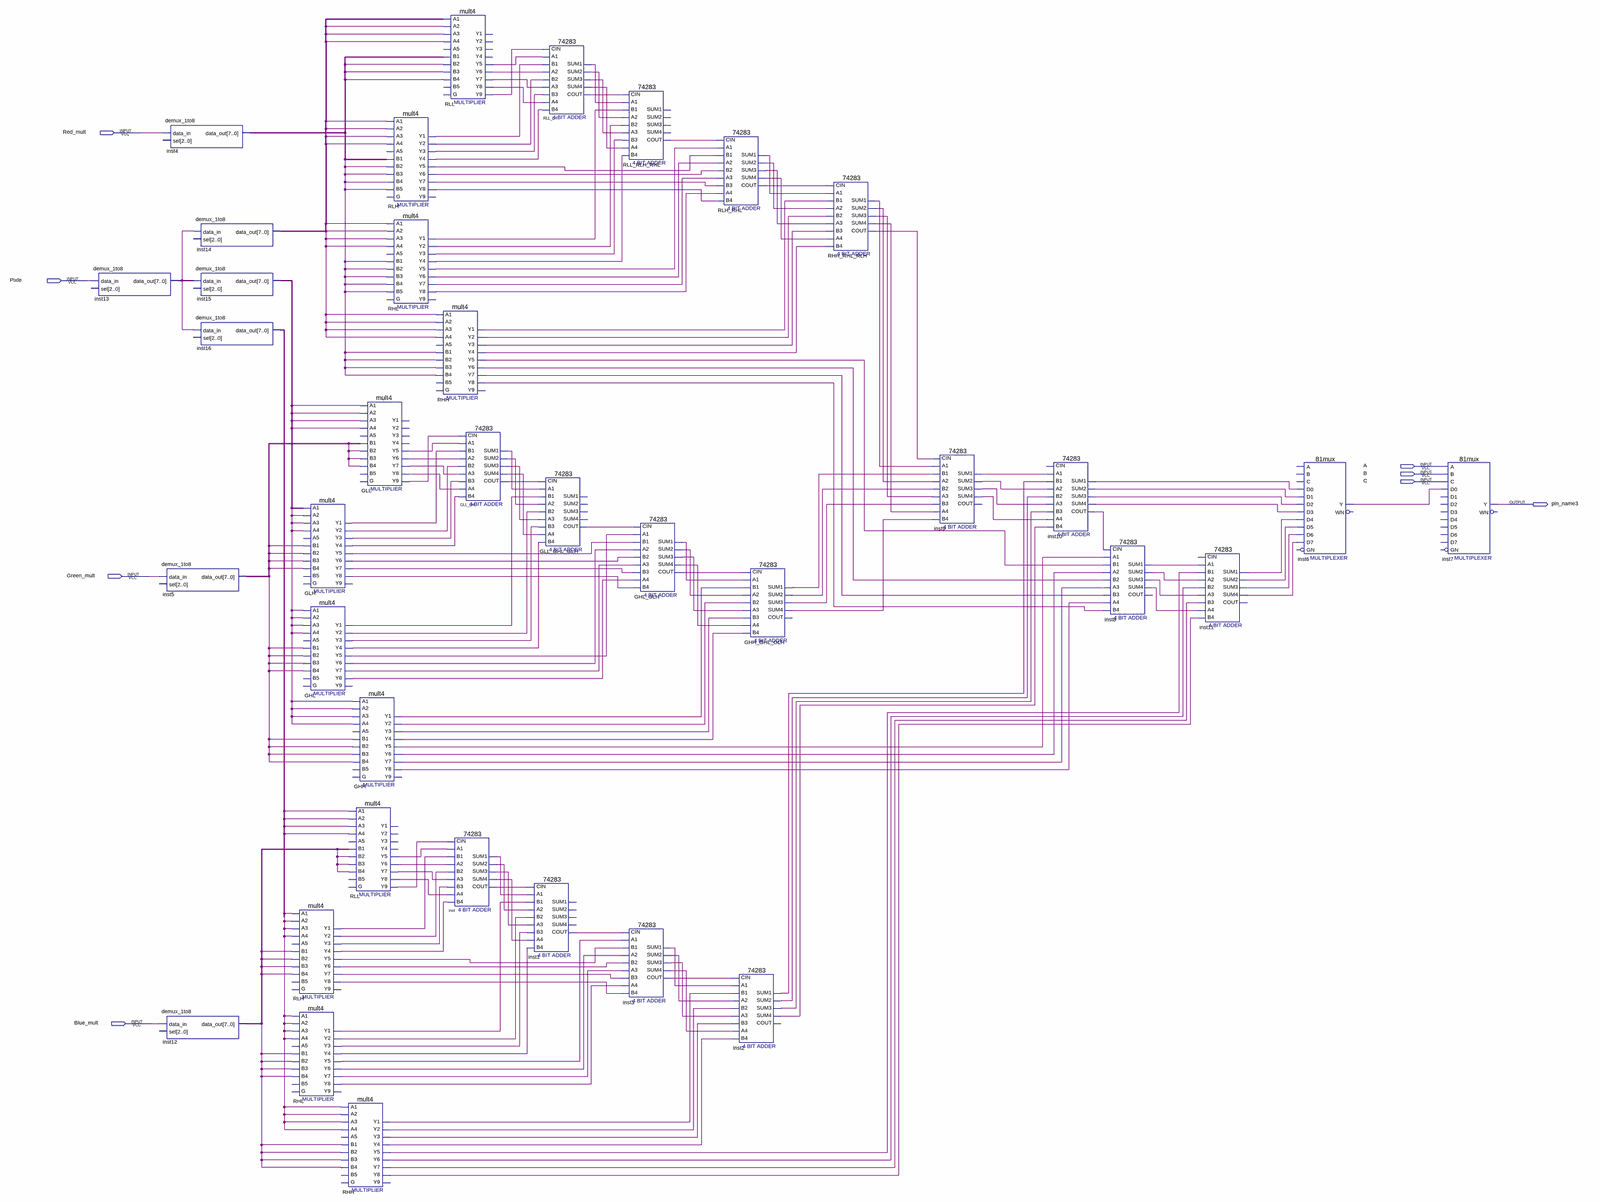
[diagram p0: schematic sheet, whole]
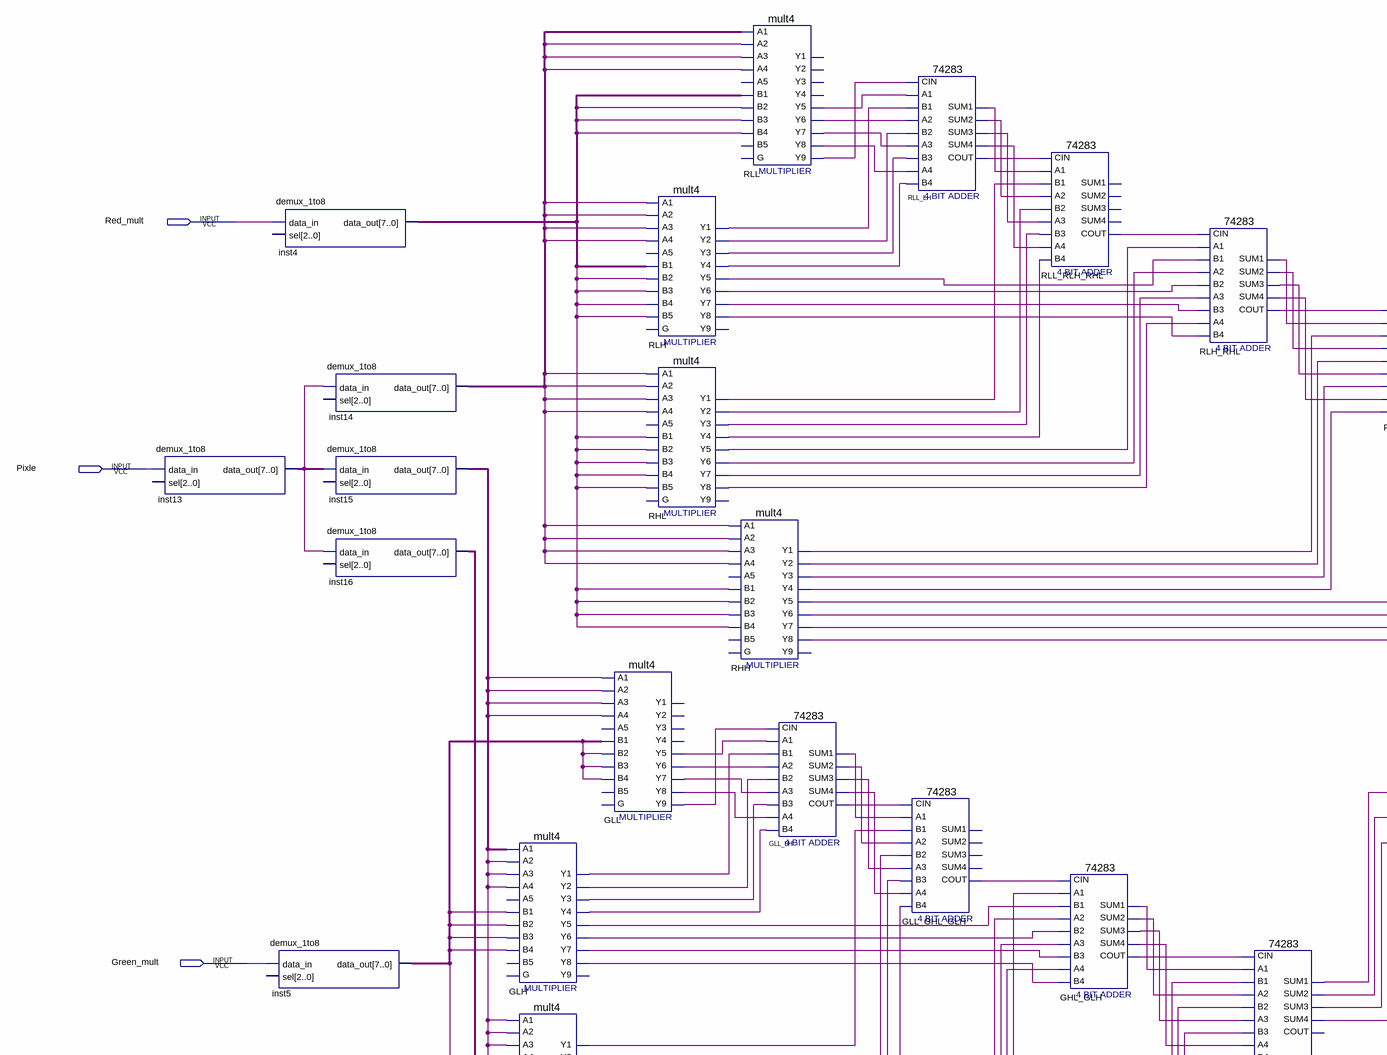
[diagram p1: schematic sheet, upper left part]
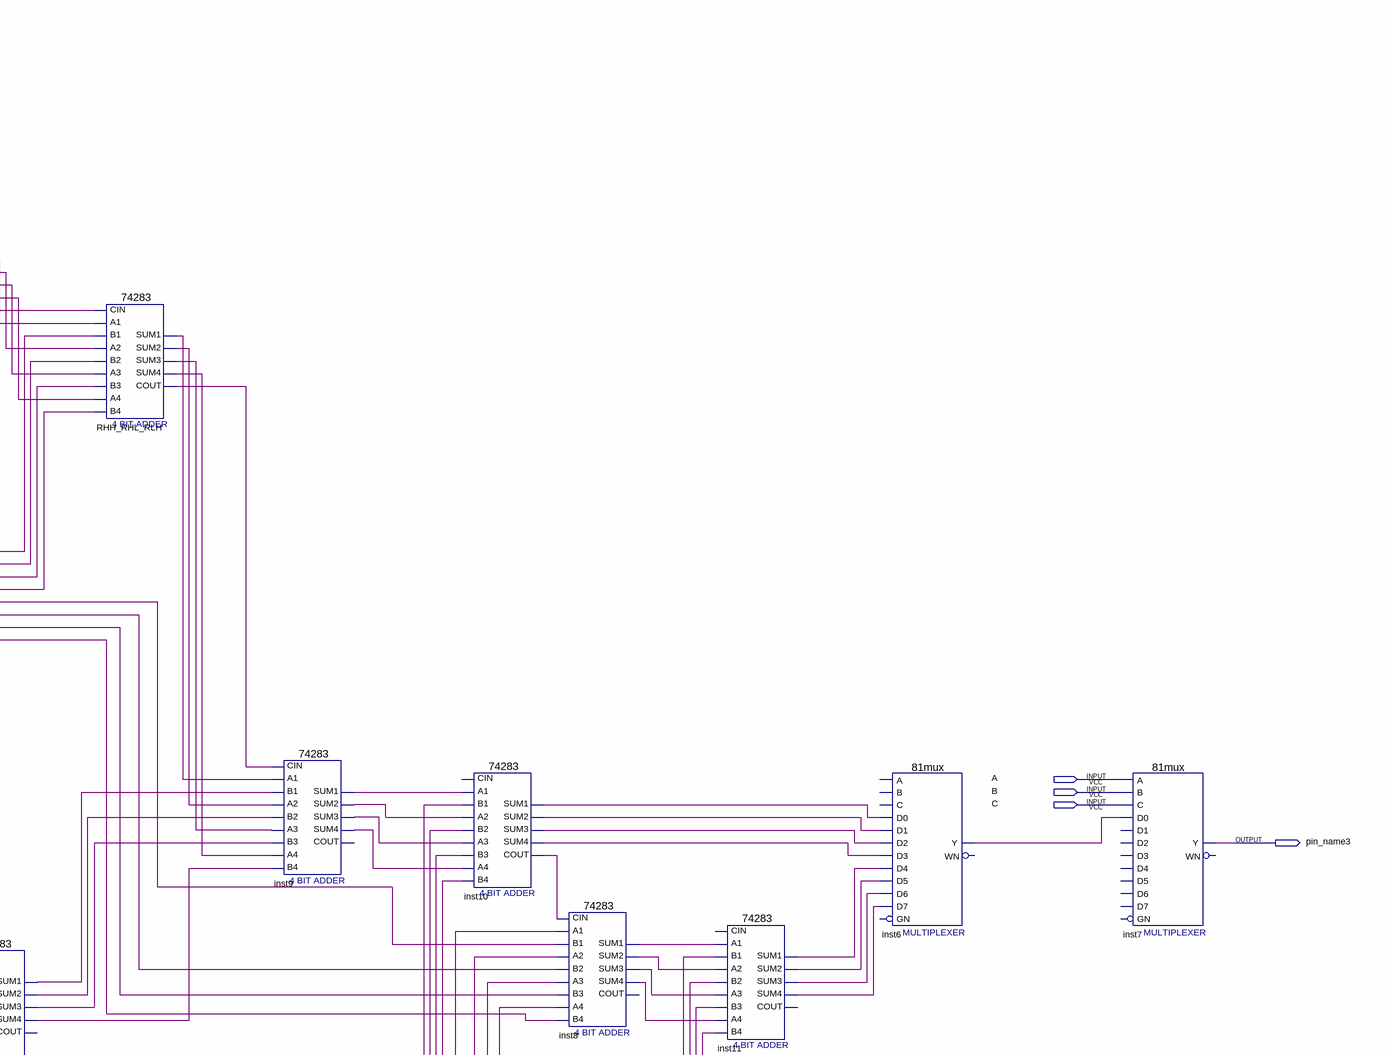
[diagram p2: schematic sheet, upper right part]
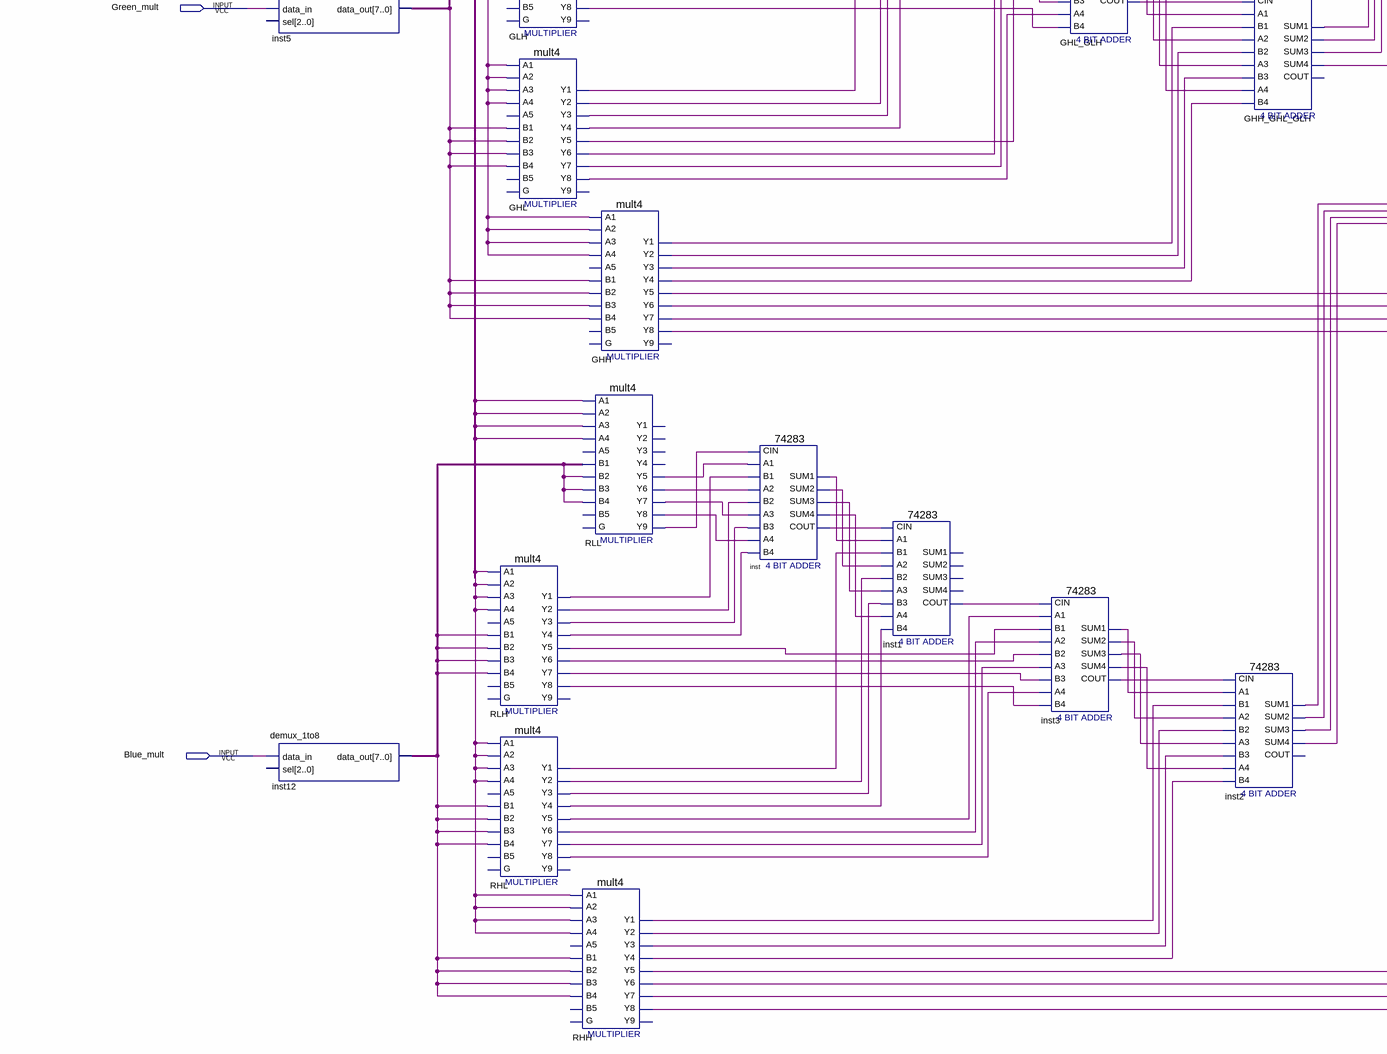
[diagram p3: schematic sheet, lower left part]
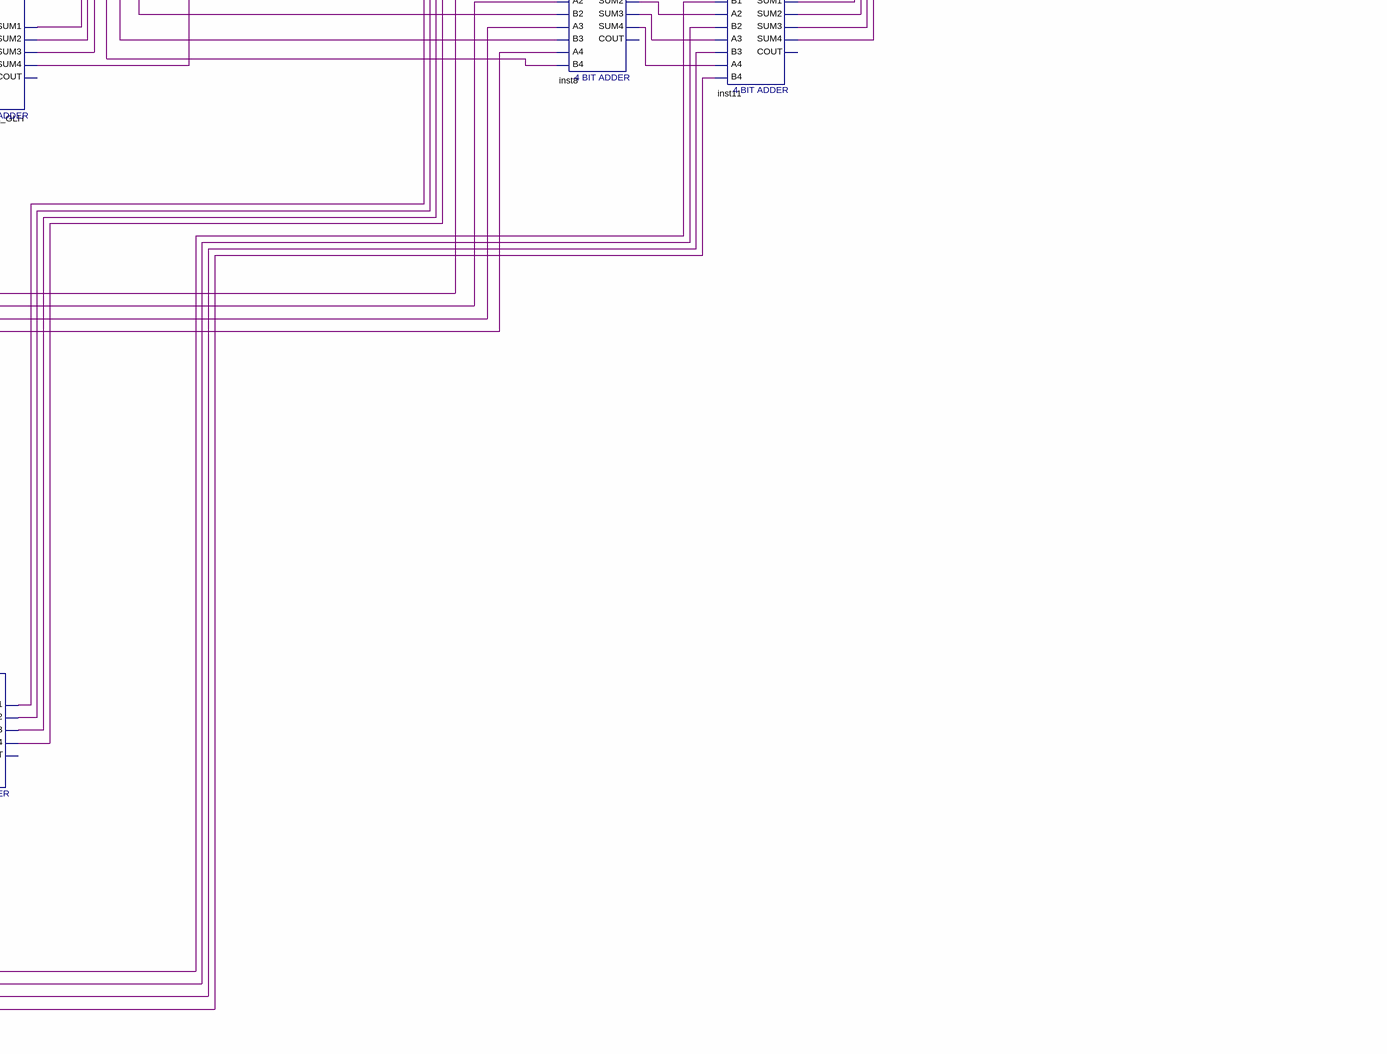
[diagram p4: schematic sheet, lower right part]
// Quartus schematic greyscale.bdf as structural Verilog: 37 symbols, 8 pins
module greyscale (
  input  Red_mult,
  input  Pixle,
  input  A,
  input  B,
  input  C,
  input  Green_mult,
  input  Blue_mult,
  output pin_name3
);

  wire GHH_GHL_GLH_sum1, GHH_GHL_GLH_sum2, GHH_GHL_GLH_sum3, GHH_GHL_GLH_sum4, GHH_y1, GHH_y2, GHH_y3,
       GHH_y4, GHH_y5, GHH_y6, GHH_y7, GHH_y8, GHL_GLH_cout, GHL_GLH_sum1, GHL_GLH_sum2, GHL_GLH_sum3,
       GHL_GLH_sum4, GHL_y1, GHL_y2, GHL_y3, GHL_y4, GHL_y5, GHL_y6, GHL_y7, GHL_y8, GLH_y1, GLH_y2, GLH_y3,
       GLH_y4, GLH_y5, GLH_y6, GLH_y7, GLH_y8, GLL_GHL_GLH_cout, GLL_LH_cout, GLL_LH_sum1, GLL_LH_sum2,
       GLL_LH_sum3, GLL_LH_sum4, GLL_y5, GLL_y6, GLL_y7, GLL_y8, GLL_y9, inst1_cout, inst2_sum1, inst2_sum2,
       inst2_sum3, inst2_sum4, inst3_cout, inst3_sum1, inst3_sum2, inst3_sum3, inst3_sum4, inst6_y,
       inst8_sum1, inst8_sum2, inst8_sum3, inst8_sum4, inst9_sum1, inst9_sum2, inst9_sum3, inst9_sum4,
       inst10_cout, inst10_sum1, inst10_sum2, inst10_sum3, inst10_sum4, inst11_sum1, inst11_sum2,
       inst11_sum3, inst11_sum4, inst_cout, inst_sum1, inst_sum2, inst_sum3, inst_sum4, RHH_RHL_RLH_cout,
       RHH_RHL_RLH_sum1, RHH_RHL_RLH_sum2, RHH_RHL_RLH_sum3, RHH_RHL_RLH_sum4, RHH_y1, RHH_y1_2, RHH_y2,
       RHH_y2_2, RHH_y3, RHH_y3_2, RHH_y4, RHH_y4_2, RHH_y5, RHH_y5_2, RHH_y6, RHH_y6_2, RHH_y7, RHH_y7_2,
       RHH_y8, RHH_y8_2, RHL_y1, RHL_y1_2, RHL_y2, RHL_y2_2, RHL_y3, RHL_y3_2, RHL_y4, RHL_y4_2, RHL_y5,
       RHL_y5_2, RHL_y6, RHL_y6_2, RHL_y7, RHL_y7_2, RHL_y8, RHL_y8_2, RLH_RHL_cout, RLH_RHL_sum1,
       RLH_RHL_sum2, RLH_RHL_sum3, RLH_RHL_sum4, RLH_y1, RLH_y1_2, RLH_y2, RLH_y2_2, RLH_y3, RLH_y3_2,
       RLH_y4, RLH_y4_2, RLH_y5, RLH_y5_2, RLH_y6, RLH_y6_2, RLH_y7, RLH_y7_2, RLH_y8, RLH_y8_2, RLL_LH_cout,
       RLL_LH_sum1, RLL_LH_sum2, RLL_LH_sum3, RLL_LH_sum4, RLL_RLH_RHL_cout, RLL_y5, RLL_y5_2, RLL_y6,
       RLL_y6_2, RLL_y7, RLL_y7_2, RLL_y8, RLL_y8_2, RLL_y9, RLL_y9_2, undriven, undriven_2, undriven_3,
       undriven_4, undriven_5, undriven_6, undriven_7, undriven_8, undriven_9, undriven_10, undriven_11,
       undriven_12, undriven_13, undriven_14, undriven_15, undriven_16, undriven_17, undriven_18,
       undriven_19, undriven_20, undriven_21, undriven_22, undriven_23, undriven_24, undriven_25,
       undriven_26, undriven_27, undriven_28, undriven_29, undriven_30, undriven_31, undriven_32,
       undriven_33, undriven_34, undriven_35, undriven_36, undriven_37;
  wire [7:0] inst4_data_out, inst5_data_out, inst12_data_out, inst13_data_out, inst14_data_out,
       inst15_data_out, inst16_data_out;

  demux_1to8 inst13 (.data_in(Pixle), .data_out(inst13_data_out));  // open: sel
  demux_1to8 inst4 (.data_in(Red_mult), .data_out(inst4_data_out));  // open: sel
  demux_1to8 inst5 (.data_in(Green_mult), .data_out(inst5_data_out));  // open: sel
  demux_1to8 inst12 (.data_in(Blue_mult), .data_out(inst12_data_out));  // open: sel
  demux_1to8 inst14 (.data_in(undriven_4), .data_out(inst14_data_out));  // open: sel
  demux_1to8 inst15 (.data_in(inst13_data_out), .data_out(inst15_data_out));  // open: sel
  demux_1to8 inst16 (.data_in(undriven_4), .data_out(inst16_data_out));  // open: sel
  mult4 GLH (
    .A2(undriven_15), .A3(undriven_15), .A4(undriven_15), .B2(undriven_28), .B1(undriven_27),
    .B3(undriven_29), .B4(undriven_30), .A1(inst15_data_out), .Y6(GLH_y6), .Y1(GLH_y1), .Y2(GLH_y2),
    .Y3(GLH_y3), .Y4(GLH_y4), .Y5(GLH_y5), .Y7(GLH_y7), .Y8(GLH_y8));  // open: A5, G, B5, Y9
  mult4 GHL (
    .A2(undriven_15), .A3(undriven_15), .A4(undriven_15), .B2(undriven_31), .B1(undriven_31),
    .B3(undriven_31), .B4(undriven_31), .A1(undriven_15), .Y6(GHL_y6), .Y1(GHL_y1), .Y2(GHL_y2), .Y3(GHL_y3),
    .Y4(GHL_y4), .Y5(GHL_y5), .Y7(GHL_y7), .Y8(GHL_y8));  // open: A5, G, B5, Y9
  mult4 RLH (
    .A2(undriven_25), .A3(undriven_25), .A4(undriven_25), .B2(undriven_34), .B1(undriven_33),
    .B3(undriven_35), .B4(undriven_36), .A1(undriven_24), .Y6(RLH_y6_2), .Y1(RLH_y1_2), .Y2(RLH_y2_2),
    .Y3(RLH_y3_2), .Y4(RLH_y4_2), .Y5(RLH_y5_2), .Y7(RLH_y7_2), .Y8(RLH_y8_2));  // open: A5, G, B5, Y9
  mult4 RHL (
    .A2(undriven_25), .A3(undriven_25), .A4(undriven_25), .B2(undriven_37), .B1(undriven_37),
    .B3(undriven_37), .B4(undriven_37), .A1(undriven_25), .Y6(RHL_y6_2), .Y1(RHL_y1_2), .Y2(RHL_y2_2),
    .Y3(RHL_y3_2), .Y4(RHL_y4_2), .Y5(RHL_y5_2), .Y7(RHL_y7_2), .Y8(RHL_y8_2));  // open: A5, G, B5, Y9
  mult4 GLL (
    .A2(undriven_17), .A3(undriven_18), .A4(undriven_19), .B2(undriven_26), .B1(inst5_data_out),
    .B3(undriven_26), .B4(undriven_26), .A1(undriven_16), .Y6(GLL_y6), .Y5(GLL_y5), .Y9(GLL_y9), .Y7(GLL_y7),
    .Y8(GLL_y8));  // open: A5, G, B5, Y1, Y2, Y3, Y4
  mult4 GHH (
    .A2(undriven_15), .A3(undriven_15), .A4(undriven_15), .B2(undriven_31), .B1(undriven_31),
    .B3(undriven_31), .B4(undriven_31), .A1(undriven_15), .Y6(GHH_y6), .Y1(GHH_y1), .Y2(GHH_y2), .Y3(GHH_y3),
    .Y4(GHH_y4), .Y5(GHH_y5), .Y7(GHH_y7), .Y8(GHH_y8));  // open: A5, G, B5, Y9
  mult4 RLL (
    .A2(undriven_21), .A3(undriven_22), .A4(undriven_23), .B2(undriven_32), .B1(inst12_data_out),
    .B3(undriven_32), .B4(undriven_32), .A1(undriven_20), .Y6(RLL_y6_2), .Y5(RLL_y5_2), .Y9(RLL_y9_2),
    .Y7(RLL_y7_2), .Y8(RLL_y8_2));  // open: A5, G, B5, Y1, Y2, Y3, Y4
  mult4 RHH (
    .A2(undriven_25), .A3(undriven_25), .A4(undriven_25), .B2(undriven_37), .B1(undriven_37),
    .B3(undriven_37), .B4(undriven_37), .A1(undriven_25), .Y6(RHH_y6_2), .Y1(RHH_y1_2), .Y2(RHH_y2_2),
    .Y3(RHH_y3_2), .Y4(RHH_y4_2), .Y5(RHH_y5_2), .Y7(RHH_y7_2), .Y8(RHH_y8_2));  // open: A5, G, B5, Y9
  mult4 RLH_dup2 (
    .A2(undriven_9), .A3(undriven_10), .A4(undriven_11), .B2(undriven_14), .B1(inst4_data_out),
    .B3(undriven_14), .B5(undriven_14), .B4(undriven_14), .A1(undriven_8), .Y6(RLH_y6), .Y1(RLH_y1),
    .Y2(RLH_y2), .Y3(RLH_y3), .Y4(RLH_y4), .Y5(RLH_y5), .Y7(RLH_y7), .Y8(RLH_y8));  // open: A5, G, Y9
  mult4 RHL_dup2 (
    .A2(undriven_13), .A3(undriven_13), .A4(undriven_13), .B2(undriven_14), .B1(undriven_14),
    .B3(undriven_14), .B5(undriven_14), .B4(undriven_14), .A1(undriven_12), .Y6(RHL_y6), .Y1(RHL_y1),
    .Y2(RHL_y2), .Y3(RHL_y3), .Y4(RHL_y4), .Y5(RHL_y5), .Y7(RHL_y7), .Y8(RHL_y8));  // open: A5, G, Y9
  mult4 RLL_dup2 (
    .A2(undriven_5), .A3(undriven_6), .A4(undriven_7), .B2(undriven), .B1(inst4_data_out), .B3(undriven_2),
    .B4(undriven_3), .A1(inst14_data_out), .Y6(RLL_y6), .Y5(RLL_y5), .Y9(RLL_y9), .Y7(RLL_y7), .Y8(RLL_y8));  // open: A5, G, B5, Y1, Y2, Y3, Y4
  mult4 RHH_dup2 (
    .A2(undriven_13), .A3(undriven_13), .A4(undriven_13), .B2(undriven_14), .B1(undriven_14),
    .B3(undriven_14), .B4(undriven_14), .A1(undriven_13), .Y6(RHH_y6), .Y1(RHH_y1), .Y2(RHH_y2), .Y3(RHH_y3),
    .Y4(RHH_y4), .Y5(RHH_y5), .Y7(RHH_y7), .Y8(RHH_y8));  // open: A5, G, B5, Y9
  \74283  GLL_LH (
    .CIN(GLL_y9), .A1(GLL_y5), .A2(GLL_y6), .B2(GLH_y2), .A3(GLL_y7), .A4(GLL_y8), .B4(GLH_y4), .B1(GLH_y1),
    .B3(GLH_y3), .SUM4(GLL_LH_sum4), .COUT(GLL_LH_cout), .SUM1(GLL_LH_sum1), .SUM2(GLL_LH_sum2),
    .SUM3(GLL_LH_sum3));
  \74283  inst (
    .CIN(RLL_y9_2), .A1(RLL_y5_2), .A2(RLL_y6_2), .B2(RLH_y2_2), .A3(RLL_y7_2), .A4(RLL_y8_2), .B4(RLH_y4_2),
    .B1(RLH_y1_2), .B3(RLH_y3_2), .SUM4(inst_sum4), .COUT(inst_cout), .SUM1(inst_sum1), .SUM2(inst_sum2),
    .SUM3(inst_sum3));
  \74283  RLL_LH (
    .CIN(RLL_y9), .A1(RLL_y5), .A2(RLL_y6), .B2(RLH_y2), .A3(RLL_y7), .A4(RLL_y8), .B4(RLH_y4), .B1(RLH_y1),
    .B3(RLH_y3), .SUM4(RLL_LH_sum4), .COUT(RLL_LH_cout), .SUM1(RLL_LH_sum1), .SUM2(RLL_LH_sum2),
    .SUM3(RLL_LH_sum3));
  \74283  GLL_GHL_GLH (
    .CIN(GLL_LH_cout), .A1(GLL_LH_sum1), .A2(GLL_LH_sum2), .B2(GHL_y2), .A3(GLL_LH_sum3), .A4(GLL_LH_sum4),
    .B4(GHL_y4), .B1(GHL_y1), .B3(GHL_y3), .COUT(GLL_GHL_GLH_cout));  // open: SUM4, SUM1, SUM2, SUM3
  \74283  inst1 (
    .CIN(inst_cout), .A1(inst_sum1), .A2(inst_sum2), .B2(RHL_y2_2), .A3(inst_sum3), .A4(inst_sum4),
    .B4(RHL_y4_2), .B1(RHL_y1_2), .B3(RHL_y3_2), .COUT(inst1_cout));  // open: SUM4, SUM1, SUM2, SUM3
  \74283  RLL_RLH_RHL (
    .CIN(RLL_LH_cout), .A1(RLL_LH_sum1), .A2(RLL_LH_sum2), .B2(RHL_y2), .A3(RLL_LH_sum3), .A4(RLL_LH_sum4),
    .B4(RHL_y4), .B1(RHL_y1), .B3(RHL_y3), .COUT(RLL_RLH_RHL_cout));  // open: SUM4, SUM1, SUM2, SUM3
  \74283  GHL_GLH (
    .CIN(GLL_GHL_GLH_cout), .A1(GHL_y5), .A2(GHL_y6), .B2(GLH_y6), .A3(GHL_y7), .A4(GHL_y8), .B4(GLH_y8),
    .B1(GLH_y5), .B3(GLH_y7), .SUM4(GHL_GLH_sum4), .COUT(GHL_GLH_cout), .SUM1(GHL_GLH_sum1),
    .SUM2(GHL_GLH_sum2), .SUM3(GHL_GLH_sum3));
  \74283  inst3 (
    .CIN(inst1_cout), .A1(RHL_y5_2), .A2(RHL_y6_2), .B2(RLH_y6_2), .A3(RHL_y7_2), .A4(RHL_y8_2),
    .B4(RLH_y8_2), .B1(RLH_y5_2), .B3(RLH_y7_2), .SUM4(inst3_sum4), .COUT(inst3_cout), .SUM1(inst3_sum1),
    .SUM2(inst3_sum2), .SUM3(inst3_sum3));
  \74283  RLH_RHL (
    .CIN(RLL_RLH_RHL_cout), .A1(RHL_y5), .A2(RHL_y6), .B2(RLH_y6), .A3(RHL_y7), .A4(RHL_y8), .B4(RLH_y8),
    .B1(RLH_y5), .B3(RLH_y7), .SUM4(RLH_RHL_sum4), .COUT(RLH_RHL_cout), .SUM1(RLH_RHL_sum1),
    .SUM2(RLH_RHL_sum2), .SUM3(RLH_RHL_sum3));
  \74283  inst2 (
    .CIN(inst3_cout), .A1(inst3_sum1), .A2(inst3_sum2), .B2(RHH_y2_2), .A3(inst3_sum3), .A4(inst3_sum4),
    .B4(RHH_y4_2), .B1(RHH_y1_2), .B3(RHH_y3_2), .SUM4(inst2_sum4), .SUM1(inst2_sum1), .SUM2(inst2_sum2),
    .SUM3(inst2_sum3));  // open: COUT
  \74283  GHH_GHL_GLH (
    .CIN(GHL_GLH_cout), .A1(GHL_GLH_sum1), .A2(GHL_GLH_sum2), .B2(GHH_y2), .A3(GHL_GLH_sum3),
    .A4(GHL_GLH_sum4), .B4(GHH_y4), .B1(GHH_y1), .B3(GHH_y3), .SUM4(GHH_GHL_GLH_sum4),
    .SUM1(GHH_GHL_GLH_sum1), .SUM2(GHH_GHL_GLH_sum2), .SUM3(GHH_GHL_GLH_sum3));  // open: COUT
  \74283  RHH_RHL_RLH (
    .CIN(RLH_RHL_cout), .A1(RLH_RHL_sum1), .A2(RLH_RHL_sum2), .B2(RHH_y2), .A3(RLH_RHL_sum3),
    .A4(RLH_RHL_sum4), .B4(RHH_y4), .B1(RHH_y1), .B3(RHH_y3), .SUM4(RHH_RHL_RLH_sum4),
    .COUT(RHH_RHL_RLH_cout), .SUM1(RHH_RHL_RLH_sum1), .SUM2(RHH_RHL_RLH_sum2), .SUM3(RHH_RHL_RLH_sum3));
  \74283  inst9 (
    .CIN(RHH_RHL_RLH_cout), .A1(RHH_RHL_RLH_sum1), .A2(RHH_RHL_RLH_sum2), .B2(GHH_GHL_GLH_sum2),
    .A3(RHH_RHL_RLH_sum3), .A4(RHH_RHL_RLH_sum4), .B4(GHH_GHL_GLH_sum4), .B1(GHH_GHL_GLH_sum1),
    .B3(GHH_GHL_GLH_sum3), .SUM4(inst9_sum4), .SUM1(inst9_sum1), .SUM2(inst9_sum2), .SUM3(inst9_sum3));  // open: COUT
  \74283  inst10 (
    .A1(inst9_sum1), .A2(inst9_sum2), .B2(inst2_sum2), .A3(inst9_sum3), .A4(inst9_sum4), .B4(inst2_sum4),
    .B1(inst2_sum1), .B3(inst2_sum3), .SUM4(inst10_sum4), .COUT(inst10_cout), .SUM1(inst10_sum1),
    .SUM2(inst10_sum2), .SUM3(inst10_sum3));  // open: CIN
  \74283  inst8 (
    .CIN(inst10_cout), .A1(GHH_y5), .A2(GHH_y6), .B2(RHH_y6), .A3(GHH_y7), .A4(GHH_y8), .B4(RHH_y8),
    .B1(RHH_y5), .B3(RHH_y7), .SUM4(inst8_sum4), .SUM1(inst8_sum1), .SUM2(inst8_sum2), .SUM3(inst8_sum3));  // open: COUT
  \74283  inst11 (
    .A1(inst8_sum1), .A2(inst8_sum2), .B2(RHH_y6_2), .A3(inst8_sum3), .A4(inst8_sum4), .B4(RHH_y8_2),
    .B1(RHH_y5_2), .B3(RHH_y7_2), .SUM4(inst11_sum4), .SUM1(inst11_sum1), .SUM2(inst11_sum2),
    .SUM3(inst11_sum3));  // open: CIN, COUT
  \81mux  inst6 (
    .D1(inst10_sum2), .D0(inst10_sum1), .D5(inst11_sum2), .D4(inst11_sum1), .D2(inst10_sum3),
    .D3(inst10_sum4), .D7(inst11_sum4), .D6(inst11_sum3), .Y(inst6_y));  // open: C, GN, A, B, WN
  \81mux  inst7 (.C(C), .D0(inst6_y), .A(A), .B(B), .Y(pin_name3));  // open: D1, D5, D4, D2, D3, GN, D7, D6, WN
endmodule
